# Altium schematic sheet Adc_I2C.SchDoc: Circuit ADC I2C
size Letter; ApprovedBy: Kevin Cotton; Author: Ing. Di Stefano; Organization: Cegep Limoilou; Address1: 1300, 8e Avenue; Address2: Québec, QC; Address3: Canada; Address4: G1J 5L5; Revision: A; SheetNumber: 2; SheetTotal: 5
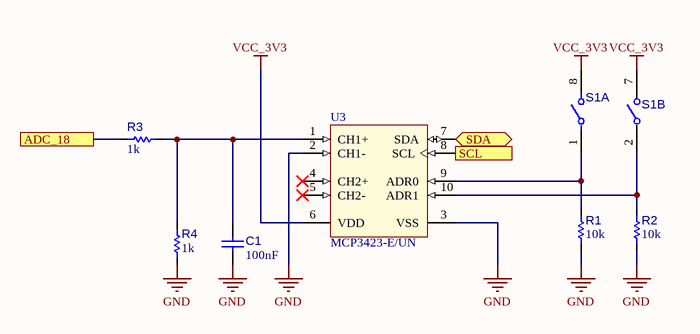
[diagram p0: Adc_I2C.SchDoc]

## Parts
C1  value 100nF  [C_1608[0603]]  (hidden comment: CAP CER 100nF 50V 0603)
R1  value 10k  [R_1608[0603]]  (hidden comment: Res 10k 1% 0603)
R2  value 10k  [R_1608[0603]]  (hidden comment: Res 10k 1% 0603)
R3  value 1k  [R_1608[0603]]  (hidden comment: Res 1k 1% 0603)
R4  value 1k  [R_1608[0603]]  (hidden comment: Res 1k 1% 0603)
S1  DSHP04TSGER  [S_DIP_SWITCH_50MIL_4POS]  (value not drawn)  (parts A,B of 4)
U3  MCP3423-E/UN  [U_MSOP50P300X500-10(RM-10)_WO-TP]

## Ports
ADC_18, SCL (in), SDA (bidir)

## Nets
GND: C1.1 R1.1 R2.1 R4.1 U3.2(CH1-) U3.3(VSS)
VCC_3V3: S1.7 S1.8 U3.6(VDD)
ADC_18: R3.1 ; port ADC_18
SCL: U3.8(SCL) ; port SCL
SDA: U3.7(SDA) ; port SDA
NetC1_2: C1.2 R3.2 R4.2 U3.1(CH1+)
NetR1_2: R1.2 S1.1 U3.9(ADR0)
NetR2_2: R2.2 S1.2 U3.10(ADR1)

Not connected (* = marked no-connect by the designer): U3 4(CH2+)* 5(CH2-)*

## Notes on the sheet
- Titre :
- Conception :
- Date :
- Approbation :
- Heure :
- Révision :
- Feuille
- de
- Fichier :

## Library data of the parts
C1 = CAP002: Capacitor type 1; Manufacturer 1: Yageo; Manufacturer Part Number 1: CC0603KRX7R9BB104; LibRef: CAP002; Code CEGEP: COND0143SM; Tolerance: 10%; Dielectric: X7R; Rated Voltage: 50V; Mounting Technology: SMT; Supplier 1: LCSC; Supplier Part Number 1: C14663
R1 R2 = RES001: Resistor type 1; Manufacturer 1: Yageo; Manufacturer Part Number 1: RC0603FR-0710KL; LibRef: RES001; Code CEGEP: RESI0238-0603; Puissance: 1/10W; Max Working Voltage: 75V; Tolerance: 1%; Mounting Technology: SMT; Supplier 1: LCSC; Supplier Part Number 1: C98220
R3 R4 = RES015: Resistor type 1; Manufacturer 1: Yageo; Manufacturer Part Number 1: RC0603FR-071KL; LibRef: RES015; Puissance: 1/10W; Max Working Voltage: 75V; Tolerance: 1%; Mounting Technology: SMT; Supplier 1: LCSC; Supplier Part Number 1: C22548
S1 = SW_DIP_50MIL_4POS: SWITCH DIP SLIDE SPST 25MA 24V, pitch 1.27mm, height 1.55mm; Manufacturer 1: kangshen; Value: DIP Switch 4pos; Manufacturer 2: Omron; Manufacturer Part Number 1: DSHP04TSGER; Manufacturer Part Number 2: A6H-4102-PM; Mounting Technology: SMT; Supplier 1: LCSC; Supplier 2: LCSC; Supplier Part Number 1: C3293144; Supplier Part Number 2: C2733274; Supplier 3: Digikey; Supplier Part Number 3: 39-A6H-4102-PMCT-ND
U3 = U_MCP3423-E/UN: CAN Controller Stand-Alone With SPI, 18-Pin PDIP; Manufacturer 1: Microchip; Manufacturer Part Number 1: MCP3423-E/UN; Supplier 1: LCSC; Supplier Part Number 1: C220864; Mounting Technology: SMT; Supplier 2: Digikey; Supplier Part Number 2: MCP3423-E/UN-ND